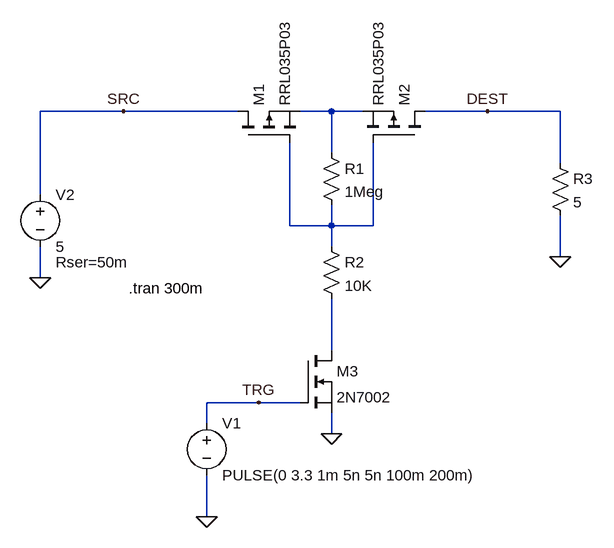
[diagram p0: schematic bus_switch.asc]
bus_switch.asc, the LTspice schematic file:
Version 4
SHEET 1 880 772
WIRE 48 128 -80 128
WIRE 224 128 48 128
WIRE 368 128 320 128
WIRE 416 128 368 128
WIRE 608 128 512 128
WIRE 720 128 608 128
WIRE 368 192 368 128
WIRE 720 208 720 128
WIRE -80 256 -80 128
WIRE 304 304 304 176
WIRE 368 304 368 272
WIRE 368 304 304 304
WIRE 432 304 432 176
WIRE 432 304 368 304
WIRE 368 336 368 304
WIRE 720 352 720 288
WIRE -80 384 -80 336
WIRE 368 496 368 416
WIRE 256 576 176 576
WIRE 320 576 256 576
WIRE 176 608 176 576
WIRE 368 624 368 592
WIRE 176 752 176 688
FLAG 368 624 0
FLAG 176 752 0
FLAG 256 576 TRG
FLAG -80 384 0
FLAG 720 352 0
FLAG 48 128 SRC
FLAG 608 128 DEST
SYMBOL pmos 512 176 M270
SYMATTR InstName M2
SYMATTR Value RRL035P03
SYMBOL res 352 176 R0
SYMATTR InstName R1
SYMATTR Value 1Meg
SYMBOL res 352 320 R0
SYMATTR InstName R2
SYMATTR Value 10K
SYMBOL nmos 320 496 R0
SYMATTR InstName M3
SYMATTR Value 2N7002
SYMBOL voltage 176 592 R0
WINDOW 123 0 0 Left 0
WINDOW 39 0 0 Left 0
SYMATTR InstName V1
SYMATTR Value PULSE(0 3.3 1m 5n 5n 100m 200m)
SYMBOL voltage -80 240 R0
WINDOW 123 0 0 Left 0
WINDOW 39 24 120 Left 2
SYMATTR InstName V2
SYMATTR Value 5
SYMATTR SpiceLine Rser=50m
SYMBOL res 704 192 R0
SYMATTR InstName R3
SYMATTR Value 5
SYMBOL pmos 224 176 R270
SYMATTR InstName M1
SYMATTR Value RRL035P03
TEXT 56 400 Left 2 !.tran 300m

The netlist it stands for:
* bus_switch.asc
M2 DEST N002 N001 N001 RRL035P03
R1 N001 N002 1Meg
R2 N002 N003 10K
M3 N003 TRG 0 0 2N7002
V1 TRG 0 PULSE(0 3.3 1m 5n 5n 100m 200m)
V2 SRC 0 5 Rser=50m
R3 DEST 0 5
M1 SRC N002 N001 N001 RRL035P03
.model NMOS NMOS
.model PMOS PMOS
.lib standard.mos
.tran 300m
.backanno
.end